# Altium schematic sheet Pump.SchDoc
size A
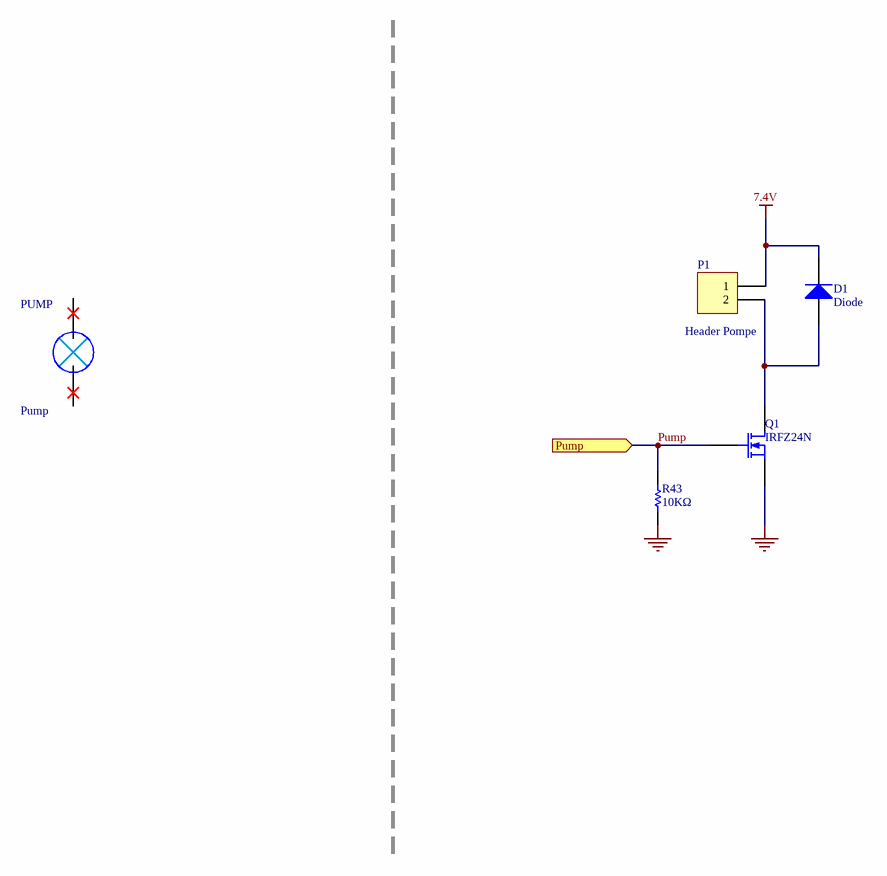
[diagram p0: Pump.SchDoc]

## Parts
D1  Diode  [DO-219AB]
P1  Header Pompe  [BORNIER]
PUMP  Pump
Q1  IRFZ24N  [TO-220AB]
R43  10KΩ  [R0603]

## Ports
Pump (in)

## Nets
7.4V: D1.2(K) P1.1
GND: Q1.3(S) R43.2
Pump: Q1.2(G) R43.1 ; port Pump
NetD1_1: D1.1(A) P1.2 Q1.1(D)

Not connected (* = marked no-connect by the designer): PUMP 1 2

## Library data of the parts
P1 = Header 2: Header, 2-Pin; Manufacturer: BUCHANAN - TE CONNECTIVITY; Ref.Manufacturer: 282834-2; LatestRevisionDate: 17-Jul-2002; LatestRevisionNote: Re-released for DXP Platform.; Publisher: Altium Limited; Ref.Farnell: 2112482; Supplier: Farnell
PUMP = Pump: Manufacturer: /; Ref.Farnell: /; Ref.Manufacturer: /; Supplier: /
Q1 = MOSFET-N: N-Channel MOSFET; Manufacturer: INFINEON; Ref.Manufacturer: IRFZ24NPBF; Published: 8-Jun-2000; LatestRevisionDate: 17-Jul-2002; LatestRevisionNote: Re-released for DXP Platform.; PackageVersion: 1995/1996; PackageReference: E3; Publisher: Altium Limited; PackageDescription: TO, Flat Index; 3 In-Line, Axial Leads; Body Dia. 4.6mm; Lead Dia. 0.5 mm (max); Ref.Farnell: 8650160; Supplier: Farnell
R43 = Res1: Resistor; Manufacturer: MULTICOMP; Ref.Manufacturer: MC0063W0603110K; Value: 1K; Published: 8-Jun-2000; LatestRevisionDate: 17-Jul-2002; LatestRevisionNote: Re-released for DXP Platform.; PackageReference: AXIAL-0.3; Publisher: Altium Limited; PackageDescription: Axial Device, Thru-Hole; 2 Leads; 0.3 in Pin Spacing; Ref.Farnell: 9330399; Supplier: Farnell
D1 = Diode: Published: 8-Jun-2000; LatestRevisionDate: 17-Jul-2002; LatestRevisionNote: Re-released for DXP Platform.; PackageVersion: Sep-1996; PackageReference: SMC; Publisher: Altium Limited; PackageDescription: DO-214-AB/SMC; 2 C-Bend Leads; Body 7.9 x 5.9 mm, inc. leads (LxW); Code_JEDEC: DO-214-AB; Supplier: Farnell